# EAGLE design lp_bubble (EAGLE 7.2.0)
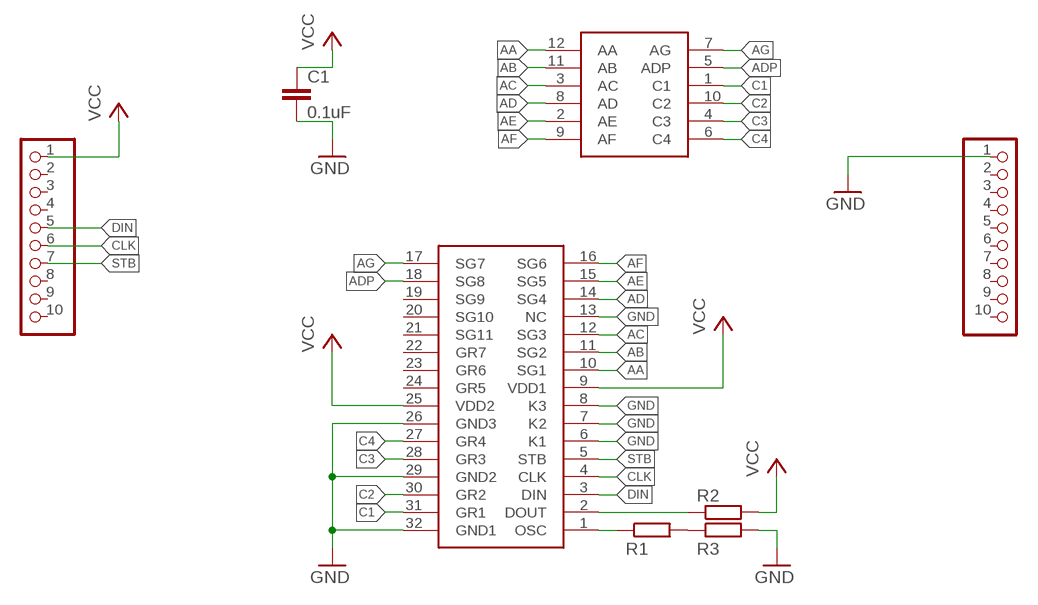
[diagram p0: schematic, sheet 1]

## Parts
C1  0.1uF  C-EUC0805  [C0805]
J1  J1  PINHD-1X10  [1X10]
J2  J2  PINHD-1X10  [1X10]
R1  50K  R-EU_M0805  [M0805]
R2  10K  R-EU_M0805  [M0805]
R3  1K  R-EU_M0805  [M0805]
U$1  HP5082-7414  [HP5082-7414]
U$3  PT6961  [PT6961]

## Nets
AA: U$1.12(AA) U$3.10(SG1)
AB: U$1.11(AB) U$3.11(SG2)
AC: U$1.3(AC) U$3.12(SG3)
AD: U$1.8(AD) U$3.14(SG4)
ADP: U$1.5(ADP) U$3.18(SG8)
AE: U$1.2(AE) U$3.15(SG5)
AF: U$1.9(AF) U$3.16(SG6)
AG: U$1.7(AG) U$3.17(SG7)
C1: U$1.1(C1) U$3.31(GR1)
C2: U$1.10(C2) U$3.30(GR2)
C3: U$1.4(C3) U$3.28(GR3)
C4: U$1.6(C4) U$3.27(GR4)
CLK: J1.6 U$3.4(CLK)
DIN: J1.5 U$3.3(DIN)
GND: C1.2 J2.1 R3.2 U$3.6(K1) U$3.7(K2) U$3.8(K3) U$3.13(NC) U$3.26(GND3) U$3.29(GND2) U$3.32(GND1)
N$1: R1.2 R3.1
N$2: R1.1 U$3.1(OSC)
N$3: R2.1 U$3.2(DOUT)
STB: J1.7 U$3.5(STB)
VCC [VCC]: C1.1 J1.1 R2.2 U$3.9(VDD1) U$3.25(VDD2)
Unconnected: J1.2 J1.3 J1.4 J1.8 J1.9 J1.10 J2.2 J2.3 J2.4 J2.5 J2.6 J2.7 J2.8 J2.9 J2.10 U$3.19(SG9) U$3.20(SG10) U$3.21(SG11) U$3.22(GR7) U$3.23(GR6) U$3.24(GR5)

## Library data of the parts
C1 = resistor:C-EU: CAPACITOR, European symbol
J1 J2 = pinhead:PINHD-1X10: PIN HEADER
R1-R3 = resistor:R-EU_: RESISTOR, European symbol
U$1 = thierry_eagle:HP5082-7414
U$3 = thierry_eagle:PT6961

## Net classes
0 default: width 0.254 mm, drill 0.508 mm
1 GND: width 0.61 mm, drill 0.508 mm
2 VCC: width 0.61 mm, drill 0.508 mm

## Board
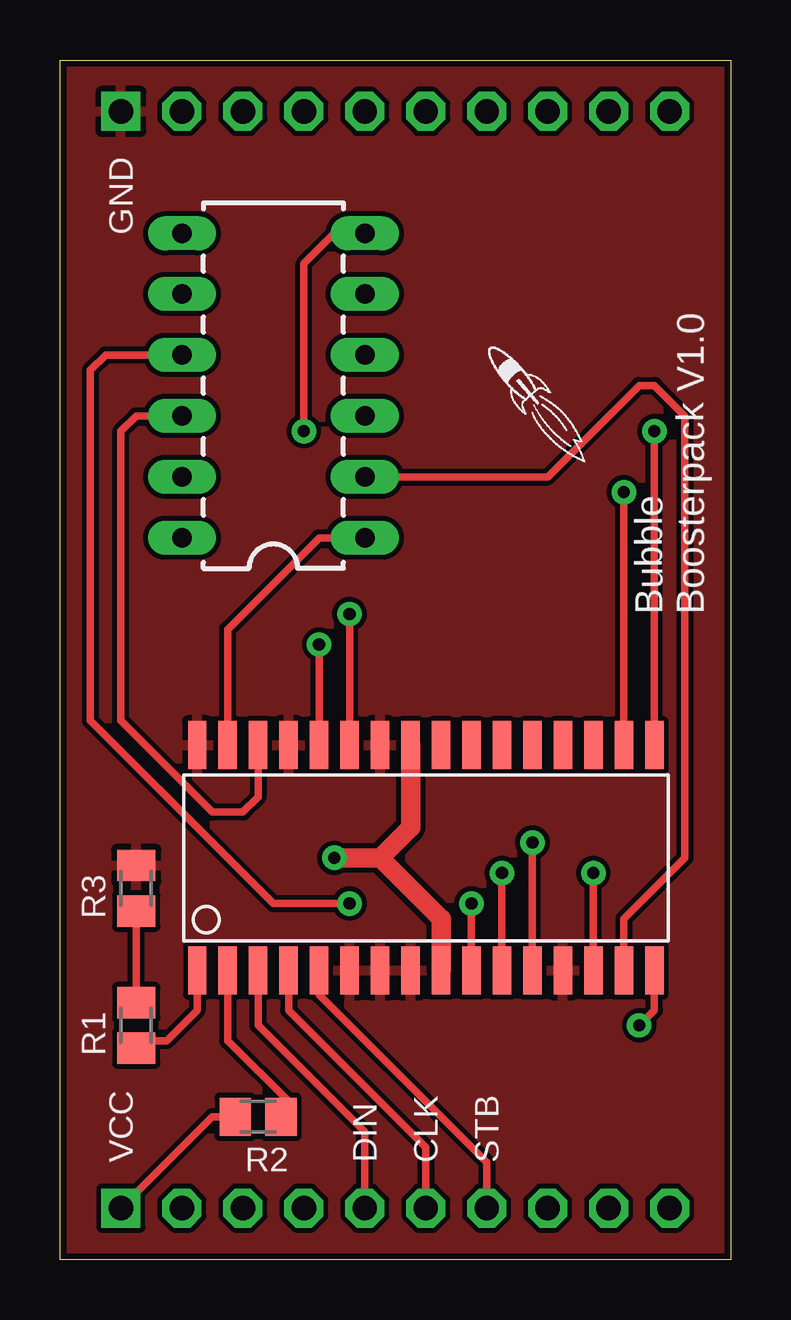
[diagram p1: board, top side]
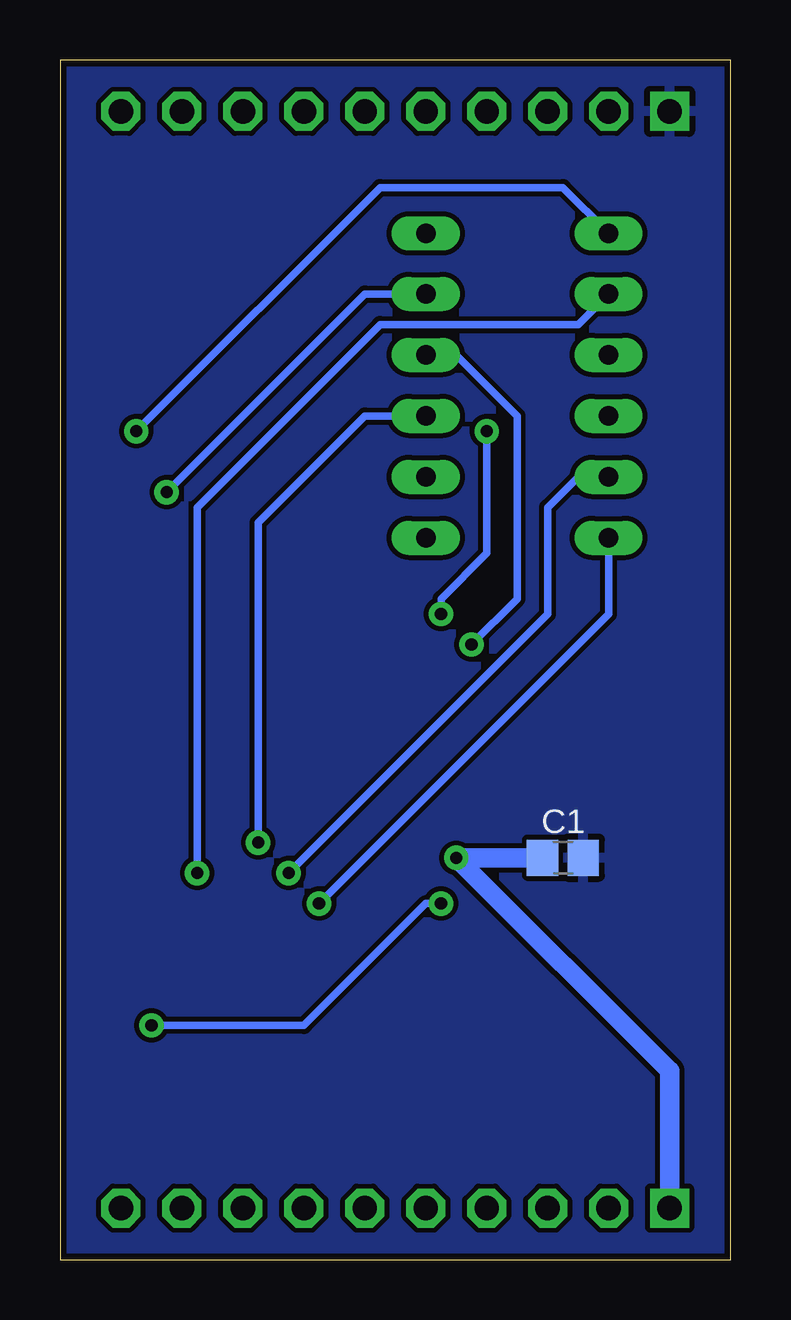
[diagram p2: board, bottom side, seen from below]

Size 27.94 x 50 mm. Coordinates in mm from the lower left corner, seen from the top.
Outline: 0,50 27.94,50 27.94,0 0,0 0,50
Copper layers (1*16): Top 0.035mm / dielectric 1.5mm / Bottom 0.035mm
Design rules "SparkFun *": minimum track width 12mil, minimum drill 20mil, track to track 8mil, track to pad 8mil, pad to pad 8mil, via to via 8mil, smd to smd 8mil, copper to edge 10mil, drill to drill 8mil, minimum pad ring 12mil, minimum via ring 10mil, stop-mask expansion 4mil, vias tented up to drill 25mil, thermal gap 10mil

### Footprints (pad centres in the part's own frame; a part is rotated, then mirrored left to right if it is on the bottom)
C0805 = smd 1.3 x 1.5: 1 -0.85,0; 2 0.85,0
1X10 = drill 1.016 square: 1 -11.43,0 | drill 1.016 octagon: 2 -8.89,0; 3 -6.35,0; 4 -3.81,0; 5 -1.27,0; 6 1.27,0; 7 3.81,0; 8 6.35,0; 9 8.89,0; 10 11.43,0
M0805 = smd 1.3 x 1.6: 1 -0.95,0; 2 0.95,0
HP5082-7414 = drill 0.813 long: 1 -7.62,-3.81; 2 -5.08,-3.81; 3 -2.54,-3.81; 4 0,-3.81; 5 2.54,-3.81; 6 5.08,-3.81; 7 5.08,3.81; 8 2.54,3.81; 9 0,3.81; 10 -2.54,3.81; 11 -5.08,3.81; 12 -7.62,3.81
PT6961 = smd 0.762 x 2: 1 -8.89,-4.7; 2 -7.62,-4.7; 3 -6.35,-4.7; 4 -5.08,-4.7; 5 -3.81,-4.7; 6 -2.54,-4.7; 7 -1.27,-4.7; 8 0,-4.7; 9 1.27,-4.7; 10 2.54,-4.7; 11 3.81,-4.7; 12 5.08,-4.7; 13 6.35,-4.7; 14 7.62,-4.7; 15 8.89,-4.7; 16 10.16,-4.7; 17 10.16,4.7; 18 8.89,4.7; 19 7.62,4.7; 20 6.35,4.7; 21 5.08,4.7; 22 3.81,4.7; 23 2.54,4.7; 24 1.27,4.7; 25 0,4.7; 26 -1.27,4.7; 27 -2.54,4.7; 28 -3.81,4.7; 29 -5.08,4.7; 30 -6.35,4.7; 31 -7.62,4.7; 32 -8.89,4.7

### Placement (x,y rotation side)
C1  6.99,16.75 0 bottom
J1  13.97,2.14 0 top
J2  13.97,47.86 0 top
R1  3.17,9.76 90 top
R2  8.26,5.95 180 top
R3  3.17,15.47 90 top
U$1  8.89,37.7 90 top
U$2  [LOGO-ROCKET]  19.68,35.8 90 top
U$3  14.61,16.75 0 top

### Tracks (layer width: path | path; a pad name or v marks a point on that pad's centre or on a via)
AA  (via drill 0.51)
  Top 0.305: U$3.10 v17.14,14.84
  Bottom 0.305: v17.14,14.84 5.08,26.91 U$1.12
AB  (via drill 0.51)
  Top 0.305: U$3.11 v18.41,16.11
  Bottom 0.305: v18.41,16.11 7.62,26.91 7.62,31.35 6.35,32.62 U$1.11
AC  (via drill 0.51)
  Top 0.305: U$3.12 v19.68,17.38
  Bottom 0.305: v19.68,17.38 19.68,30.71 15.24,35.16 U$1.3
AD  (via drill 0.51)
  Top 0.305: U$3.14 v22.23,16.11
  Bottom 0.305: v22.23,16.11 22.23,31.35 14.61,38.97 6.35,38.97 U$1.8
ADP  (via drill 0.51)
  Top 0.305: U$3.18 v23.5,31.98
  Bottom 0.305: v23.5,31.98 15.24,40.24 U$1.5
AE
  Top 0.305: U$1.2 20.32,32.62 24.13,36.43 24.77,36.43 26.04,35.16 26.04,16.75 23.5,14.21 U$3.15
AF  (via drill 0.51)
  Top 0.305: U$1.9 1.91,37.7 1.27,37.07 1.27,22.46 8.89,14.84 v12.06,14.84 | v24.13,9.76 24.77,10.39 U$3.16
  Bottom 0.305: v12.06,14.84 12.7,14.84 17.78,9.76 v24.13,9.76
AG  (via drill 0.51)
  Top 0.305: U$3.17 v24.77,34.52
  Bottom 0.305: v24.77,34.52 14.61,44.69 6.99,44.69 U$1.7
C1
  Top 0.305: U$3.31 6.99,26.27 10.79,30.08 U$1.1
C2
  Top 0.305: U$3.30 8.26,19.29 7.62,18.65 6.35,18.65 2.54,22.46 2.54,34.52 3.17,35.16 U$1.10
C3  (via drill 0.51)
  Top 0.305: U$3.28 v10.79,25.64
  Bottom 0.305: v10.79,25.64 8.89,27.54 8.89,35.16 11.43,37.7 U$1.4
C4  (via drill 0.51)
  Top 0.305: U$3.27 v12.06,26.91 | v10.16,34.52 10.16,41.51 11.43,42.78 U$1.6
  Bottom 0.305: v12.06,26.91 12.06,27.54 10.16,29.45 v10.16,34.52
CLK
  Top 0.305: U$3.4 9.53,10.39 15.24,4.68 J1.6
DIN
  Top 0.305: J1.5 12.7,5.31 8.26,9.76 U$3.3
GND
  pour Bottom: 29.17,51.67 29.17,-1.67 -1.37,-1.77 -1.37,51.67
  pour Top: -1.37,51.67 29.21,51.67 29.21,-1.67 -1.37,-1.77
N$1
  Top 0.305: R1.2 R3.1
N$2
  Top 0.305: U$3.1 5.71,10.39 4.45,9.12 3.49,9.12 R1.1
N$3
  Top 0.305: U$3.2 6.99,9.12 9.53,6.58 9.53,6.27 R2.1
STB
  Top 0.305: U$3.5 10.79,11.03 17.78,4.04 J1.7
VCC  (via drill 0.51)
  Top 0.305: R2.2 6.35,5.95 J1.1
  Top 0.813: v11.43,16.75 13.34,16.75 | 13.34,16.75 15.88,14.21 U$3.9 | U$3.25 14.61,18.02 13.34,16.75
  Bottom 0.813: J1.1 2.54,7.86 v11.43,16.75 C1.1

### Text on the board
tNames: GND | Bubble / Boosterpack V1.0 | VCC | DIN | CLK | STB